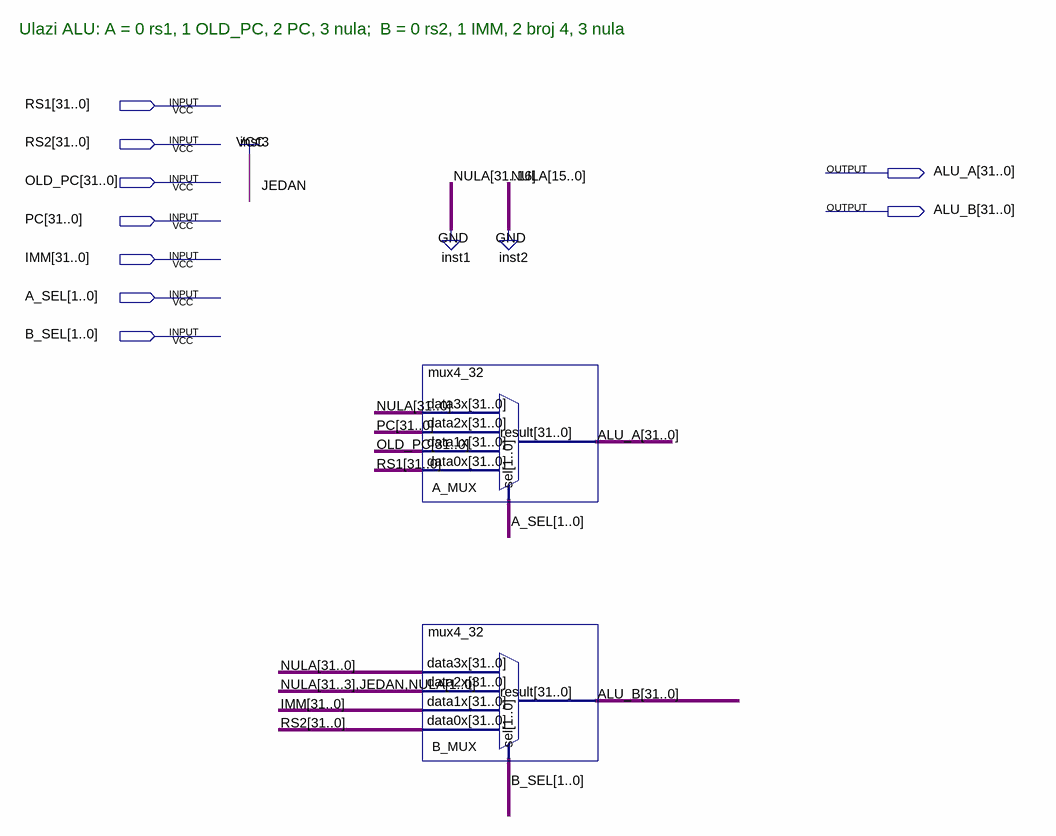
[diagram p0: schematic sheet]
// Quartus schematic alu_src_mux.bdf as structural Verilog: 2 symbols, 9 pins
module alu_src_mux (
  input  [31:0] RS1,
  input  [31:0] RS2,
  input  [31:0] OLD_PC,
  input  [31:0] PC,
  input  [31:0] IMM,
  input  [1:0] A_SEL,
  input  [1:0] B_SEL,
  output [31:0] ALU_A,
  output [31:0] ALU_B
);

  mux4_32 A_MUX (.data3x({32{1'b0}}), .data2x(PC), .data1x(OLD_PC), .data0x(RS1), .sel(A_SEL), .result(ALU_A));
  mux4_32 B_MUX (
    .data3x({32{1'b0}}), .data2x(32'b00000000000000000000000000000100), .data1x(IMM), .data0x(RS2),
    .sel(B_SEL), .result(ALU_B));

  // Notes on the sheet:
  //   Ulazi ALU: A = 0 rs1, 1 OLD_PC, 2 PC, 3 nula;  B = 0 rs2, 1 IMM, 2 broj 4, 3 nula
endmodule
